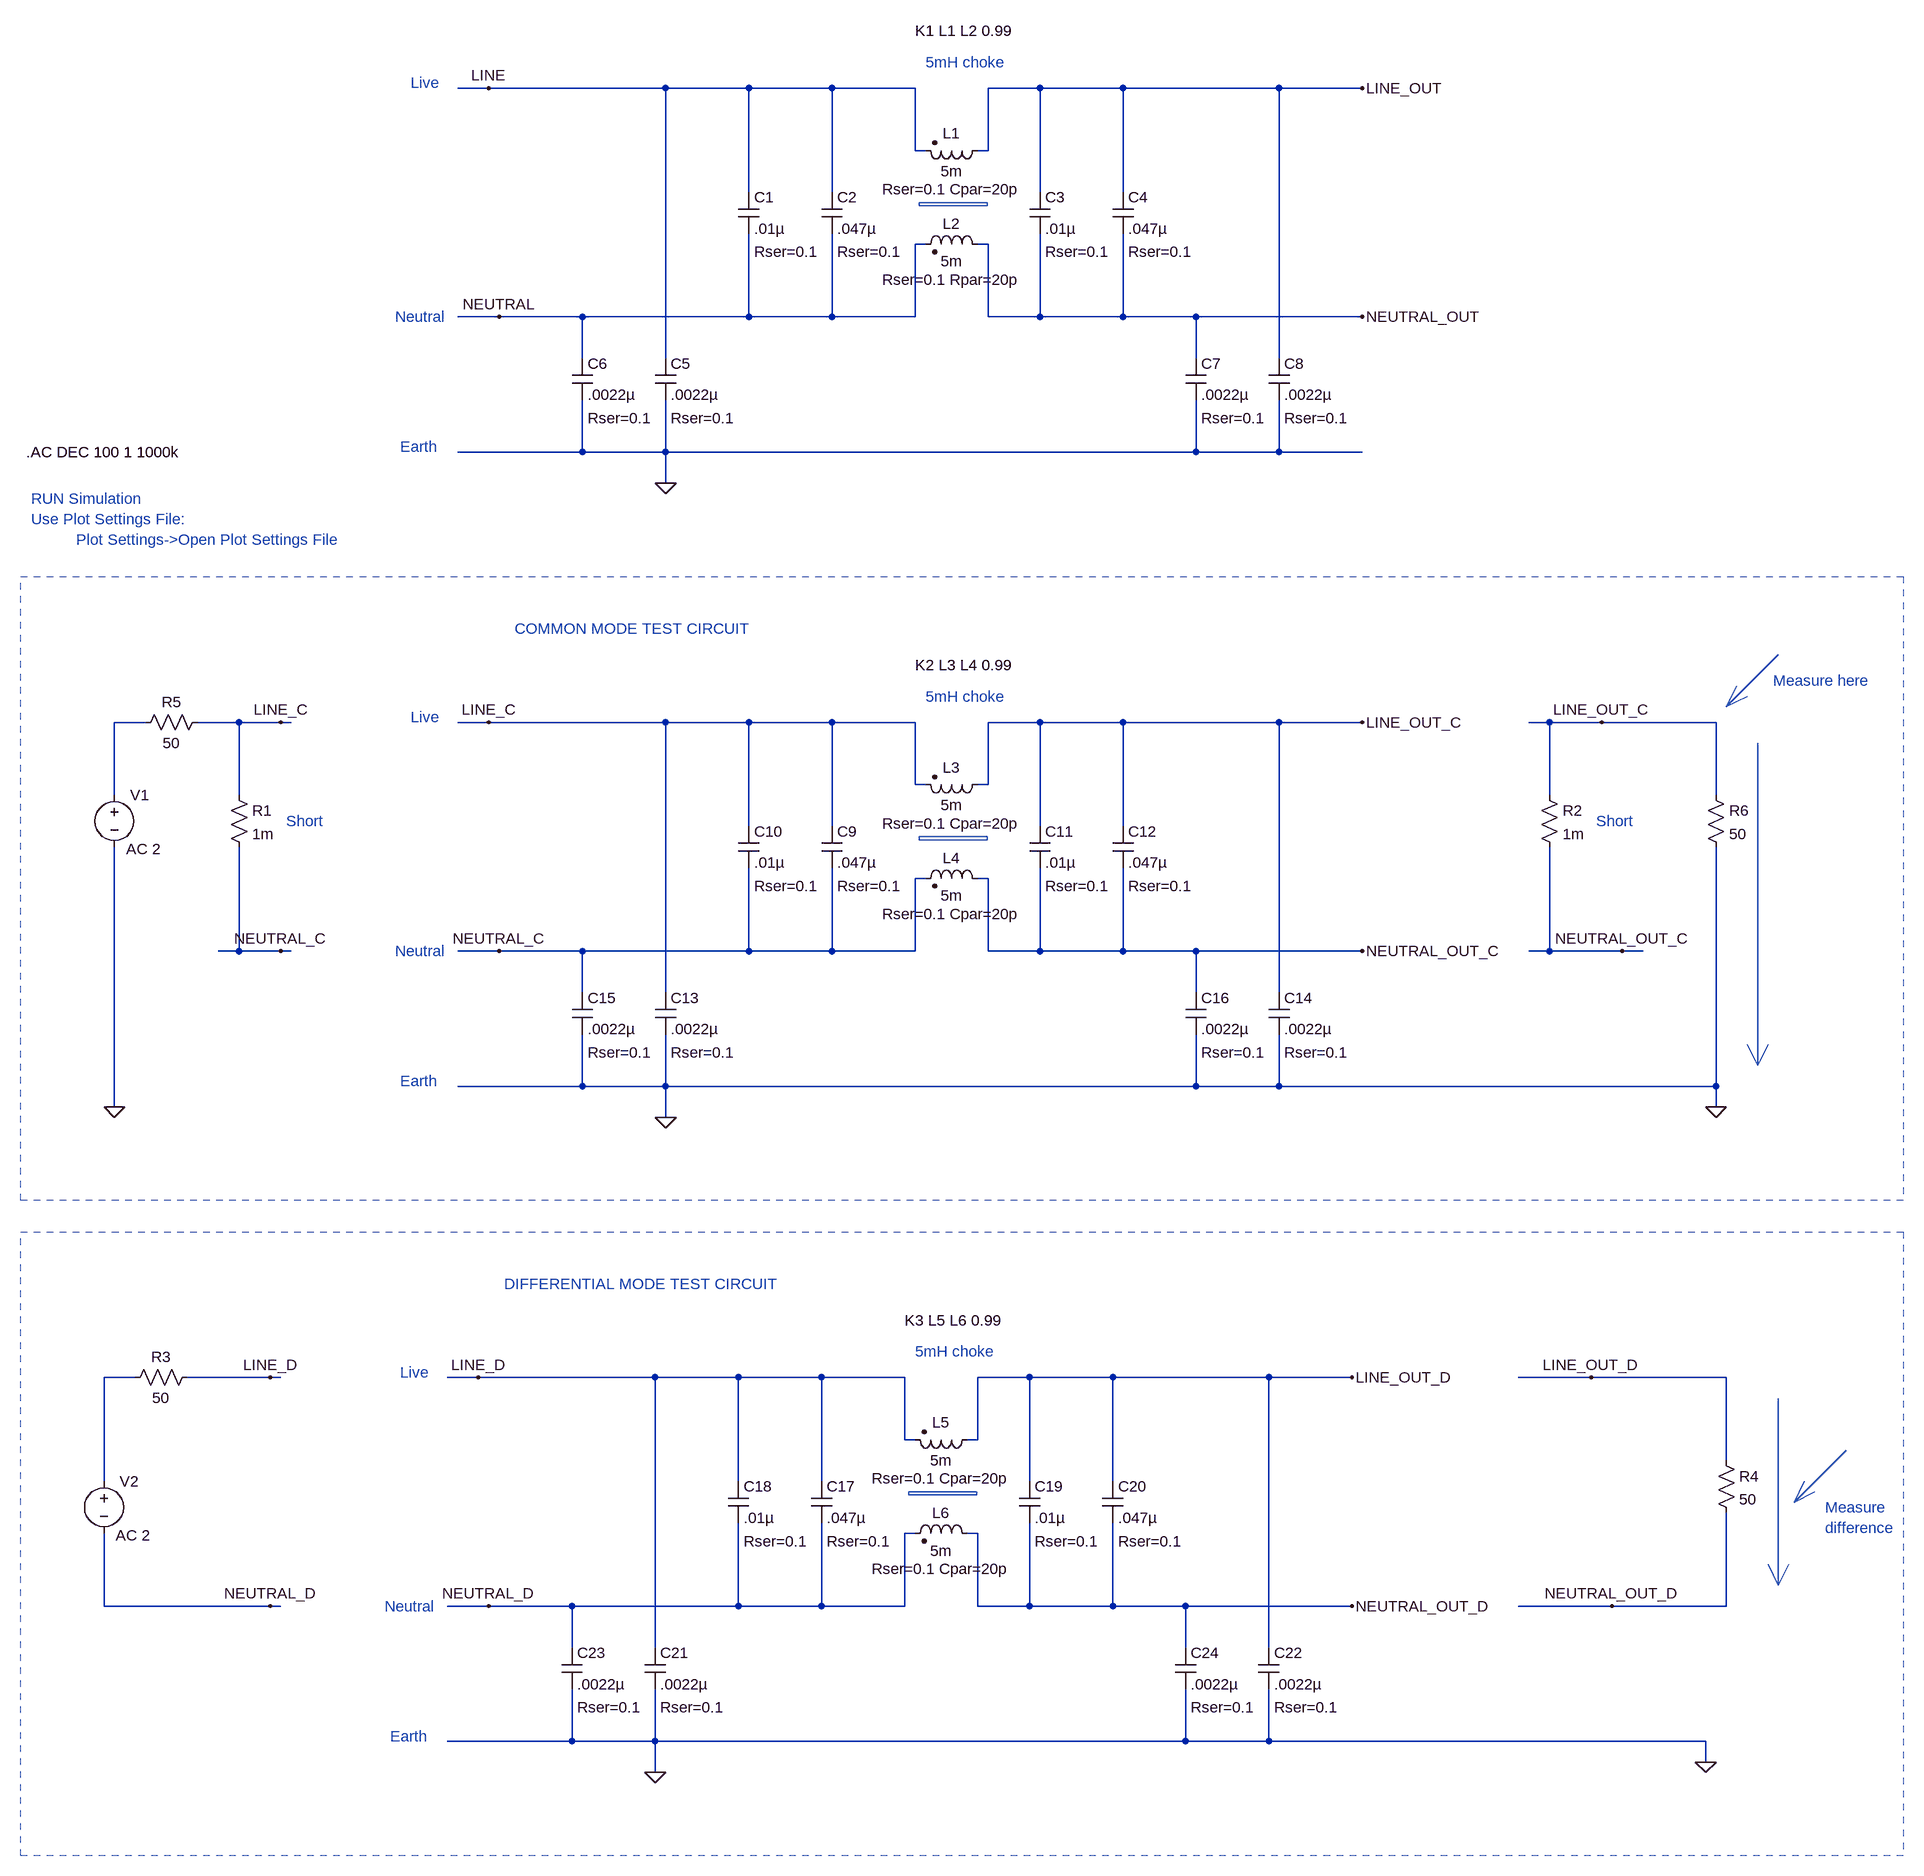
[diagram p0: schematic Mains_Filter2.asc]
Mains_Filter2.asc, the LTspice schematic file:
Version 4
SHEET 1 1508 1908
WIRE -320 -768 -320 -864
WIRE -320 -864 -448 -864
WIRE -320 -624 -320 -512
WIRE -320 -512 -448 -512
WIRE -208 -768 -208 -864
WIRE -208 -864 -128 -864
WIRE -448 -704 -448 -864
WIRE -448 -864 -576 -864
WIRE -448 -640 -448 -512
WIRE -448 -512 -576 -512
WIRE -576 -704 -576 -864
WIRE -576 -864 -704 -864
WIRE -576 -640 -576 -512
WIRE -576 -512 -832 -512
WIRE -128 -704 -128 -864
WIRE -128 -864 0 -864
WIRE -128 -640 -128 -512
WIRE -128 -512 0 -512
WIRE 0 -704 0 -864
WIRE 240 -864 0 -864
WIRE 0 -640 0 -512
WIRE -704 -448 -704 -864
WIRE -704 -864 -976 -864
WIRE -704 -384 -704 -304
WIRE -704 -304 112 -304
WIRE 240 -384 240 -304
WIRE 112 -304 240 -304
WIRE -832 -448 -832 -512
WIRE -832 -384 -832 -304
WIRE 112 -448 112 -512
WIRE 112 -384 112 -304
WIRE -1552 112 -1504 112
WIRE -1552 112 -1552 224
WIRE -1424 112 -1360 112
WIRE -1296 112 -1280 112
WIRE -960 -512 -1024 -512
WIRE -1552 704 -1552 304
WIRE 240 -864 368 -864
WIRE 112 -512 368 -512
WIRE -1024 -304 -832 -304
WIRE -704 -304 -704 -256
WIRE 240 -304 368 -304
WIRE 240 -448 240 -864
WIRE -208 -624 -208 -512
WIRE -208 -512 -128 -512
WIRE -832 -512 -960 -512
WIRE -832 -304 -704 -304
WIRE -224 -768 -208 -768
WIRE -304 -768 -320 -768
WIRE -304 -624 -320 -624
WIRE -224 -624 -208 -624
WIRE 112 -512 0 -512
WIRE -976 -864 -1024 -864
WIRE -320 208 -320 112
WIRE -320 112 -448 112
WIRE -320 352 -320 464
WIRE -320 464 -448 464
WIRE -208 208 -208 112
WIRE -208 112 -128 112
WIRE -448 272 -448 112
WIRE -448 112 -576 112
WIRE -448 336 -448 464
WIRE -448 464 -576 464
WIRE -576 272 -576 112
WIRE -576 112 -704 112
WIRE -576 336 -576 464
WIRE -576 464 -832 464
WIRE -128 272 -128 112
WIRE -128 112 0 112
WIRE -128 336 -128 464
WIRE -128 464 0 464
WIRE 0 272 0 112
WIRE 240 112 0 112
WIRE 0 336 0 464
WIRE -704 528 -704 112
WIRE -704 112 -976 112
WIRE -704 592 -704 672
WIRE -704 672 112 672
WIRE 240 592 240 672
WIRE 112 672 240 672
WIRE -832 528 -832 464
WIRE -832 592 -832 672
WIRE 112 528 112 464
WIRE 112 592 112 672
WIRE -960 464 -1024 464
WIRE 240 112 368 112
WIRE 112 464 368 464
WIRE -1024 672 -832 672
WIRE -704 672 -704 720
WIRE 240 672 912 672
WIRE 240 528 240 112
WIRE -208 352 -208 464
WIRE -208 464 -128 464
WIRE -832 464 -960 464
WIRE -832 672 -704 672
WIRE -224 208 -208 208
WIRE -304 208 -320 208
WIRE -304 352 -320 352
WIRE -224 352 -208 352
WIRE 112 464 0 464
WIRE -976 112 -1024 112
WIRE -1360 224 -1360 112
WIRE -1360 112 -1296 112
WIRE -1360 304 -1360 464
WIRE -1392 464 -1360 464
WIRE -1360 464 -1296 464
WIRE -1296 464 -1280 464
WIRE 656 112 736 112
WIRE 656 224 656 112
WIRE 656 304 656 464
WIRE 624 464 656 464
WIRE 656 464 768 464
WIRE 768 464 800 464
WIRE 656 112 624 112
WIRE 912 704 912 672
WIRE 736 112 912 112
WIRE -1568 1120 -1520 1120
WIRE -1568 1120 -1568 1280
WIRE -1440 1120 -1312 1120
WIRE -1312 1120 -1296 1120
WIRE -1568 1472 -1568 1360
WIRE -336 1216 -336 1120
WIRE -336 1120 -464 1120
WIRE -336 1360 -336 1472
WIRE -336 1472 -464 1472
WIRE -224 1216 -224 1120
WIRE -224 1120 -144 1120
WIRE -464 1280 -464 1120
WIRE -464 1120 -592 1120
WIRE -464 1344 -464 1472
WIRE -464 1472 -592 1472
WIRE -592 1280 -592 1120
WIRE -592 1120 -720 1120
WIRE -592 1344 -592 1472
WIRE -592 1472 -848 1472
WIRE -144 1280 -144 1120
WIRE -144 1120 -16 1120
WIRE -144 1344 -144 1472
WIRE -144 1472 -16 1472
WIRE -16 1280 -16 1120
WIRE 224 1120 -16 1120
WIRE -16 1344 -16 1472
WIRE -720 1536 -720 1120
WIRE -720 1120 -992 1120
WIRE -720 1600 -720 1680
WIRE -720 1680 96 1680
WIRE 224 1600 224 1680
WIRE 96 1680 224 1680
WIRE -848 1536 -848 1472
WIRE -848 1600 -848 1680
WIRE 96 1536 96 1472
WIRE 96 1600 96 1680
WIRE -976 1472 -1040 1472
WIRE 224 1120 352 1120
WIRE 96 1472 352 1472
WIRE -1040 1680 -848 1680
WIRE -720 1680 -720 1728
WIRE 224 1680 896 1680
WIRE 224 1536 224 1120
WIRE -224 1360 -224 1472
WIRE -224 1472 -144 1472
WIRE -848 1472 -976 1472
WIRE -848 1680 -720 1680
WIRE -240 1216 -224 1216
WIRE -320 1216 -336 1216
WIRE -320 1360 -336 1360
WIRE -240 1360 -224 1360
WIRE 96 1472 -16 1472
WIRE -992 1120 -1040 1120
WIRE -1568 1472 -1312 1472
WIRE -1312 1472 -1296 1472
WIRE 608 1120 720 1120
WIRE 608 1472 752 1472
WIRE 896 1712 896 1680
WIRE 720 1120 928 1120
WIRE 928 1248 928 1120
WIRE 928 1328 928 1472
WIRE 752 1472 928 1472
WIRE 912 224 912 112
WIRE 912 304 912 672
FLAG -704 -256 0
FLAG -1296 112 LINE_C
FLAG -976 -864 LINE
FLAG -960 -512 NEUTRAL
FLAG 368 -864 LINE_OUT
FLAG 368 -512 NEUTRAL_OUT
FLAG -1552 704 0
FLAG -704 720 0
FLAG -976 112 LINE_C
FLAG -960 464 NEUTRAL_C
FLAG 368 112 LINE_OUT_C
FLAG 368 464 NEUTRAL_OUT_C
FLAG -1296 464 NEUTRAL_C
FLAG 736 112 LINE_OUT_C
FLAG 768 464 NEUTRAL_OUT_C
FLAG 912 704 0
FLAG -1312 1120 LINE_D
FLAG -720 1728 0
FLAG -992 1120 LINE_D
FLAG -976 1472 NEUTRAL_D
FLAG 352 1120 LINE_OUT_D
FLAG 352 1472 NEUTRAL_OUT_D
FLAG -1312 1472 NEUTRAL_D
FLAG 720 1120 LINE_OUT_D
FLAG 752 1472 NEUTRAL_OUT_D
FLAG 896 1712 0
SYMBOL ind2 -208 -784 R90
WINDOW 0 5 56 VBottom 0
WINDOW 3 32 56 VTop 0
WINDOW 39 60 56 VTop 0
SYMATTR InstName L1
SYMATTR Value 5m
SYMATTR Type ind
SYMATTR SpiceLine Rser=0.1 Cpar=20p
SYMBOL cap -464 -704 R0
WINDOW 39 24 92 Left 0
SYMATTR InstName C2
SYMATTR Value .047µ
SYMATTR SpiceLine Rser=0.1
SYMBOL cap -592 -704 R0
WINDOW 39 24 92 Left 0
SYMATTR InstName C1
SYMATTR Value .01µ
SYMATTR SpiceLine Rser=0.1
SYMBOL cap -144 -704 R0
WINDOW 39 24 92 Left 0
SYMATTR InstName C3
SYMATTR Value .01µ
SYMATTR SpiceLine Rser=0.1
SYMBOL cap -16 -704 R0
WINDOW 39 24 92 Left 0
SYMATTR InstName C4
SYMATTR Value .047µ
SYMATTR SpiceLine Rser=0.1
SYMBOL cap -720 -448 R0
WINDOW 39 24 92 Left 0
SYMATTR InstName C5
SYMATTR Value .0022µ
SYMATTR SpiceLine Rser=0.1
SYMBOL cap 224 -448 R0
WINDOW 39 24 92 Left 0
SYMATTR InstName C8
SYMATTR Value .0022µ
SYMATTR SpiceLine Rser=0.1
SYMBOL ind2 -208 -608 M270
WINDOW 0 32 56 VTop 0
WINDOW 3 5 56 VBottom 0
WINDOW 39 -23 56 VBottom 0
SYMATTR InstName L2
SYMATTR Value 5m
SYMATTR Type ind
SYMATTR SpiceLine Rser=0.1 Rpar=20p
SYMBOL cap -848 -448 R0
WINDOW 39 24 92 Left 0
SYMATTR InstName C6
SYMATTR Value .0022µ
SYMATTR SpiceLine Rser=0.1
SYMBOL cap 96 -448 R0
WINDOW 39 24 92 Left 0
SYMATTR InstName C7
SYMATTR Value .0022µ
SYMATTR SpiceLine Rser=0.1
SYMBOL res -1520 128 R270
WINDOW 0 32 56 VTop 0
WINDOW 3 0 56 VBottom 0
SYMATTR InstName R5
SYMATTR Value 50
SYMBOL voltage -1552 208 R0
WINDOW 123 18 99 Left 0
WINDOW 39 0 0 Left 0
SYMATTR InstName V1
SYMATTR Value ""
SYMATTR Value2 AC 2
SYMBOL ind2 -208 192 R90
WINDOW 0 5 56 VBottom 0
WINDOW 3 32 56 VTop 0
WINDOW 39 60 56 VTop 0
SYMATTR InstName L3
SYMATTR Value 5m
SYMATTR Type ind
SYMATTR SpiceLine Rser=0.1 Cpar=20p
SYMBOL cap -464 272 R0
WINDOW 39 24 92 Left 0
SYMATTR InstName C9
SYMATTR Value .047µ
SYMATTR SpiceLine Rser=0.1
SYMBOL cap -592 272 R0
WINDOW 39 24 92 Left 0
SYMATTR InstName C10
SYMATTR Value .01µ
SYMATTR SpiceLine Rser=0.1
SYMBOL cap -144 272 R0
WINDOW 39 24 92 Left 0
SYMATTR InstName C11
SYMATTR Value .01µ
SYMATTR SpiceLine Rser=0.1
SYMBOL cap -16 272 R0
WINDOW 39 24 92 Left 0
SYMATTR InstName C12
SYMATTR Value .047µ
SYMATTR SpiceLine Rser=0.1
SYMBOL cap -720 528 R0
WINDOW 39 24 92 Left 0
SYMATTR InstName C13
SYMATTR Value .0022µ
SYMATTR SpiceLine Rser=0.1
SYMBOL cap 224 528 R0
WINDOW 39 24 92 Left 0
SYMATTR InstName C14
SYMATTR Value .0022µ
SYMATTR SpiceLine Rser=0.1
SYMBOL ind2 -208 368 M270
WINDOW 0 32 56 VTop 0
WINDOW 3 5 56 VBottom 0
WINDOW 39 -23 56 VBottom 0
SYMATTR InstName L4
SYMATTR Value 5m
SYMATTR Type ind
SYMATTR SpiceLine Rser=0.1 Cpar=20p
SYMBOL cap -848 528 R0
WINDOW 39 24 92 Left 0
SYMATTR InstName C15
SYMATTR Value .0022µ
SYMATTR SpiceLine Rser=0.1
SYMBOL cap 96 528 R0
WINDOW 39 24 92 Left 0
SYMATTR InstName C16
SYMATTR Value .0022µ
SYMATTR SpiceLine Rser=0.1
SYMBOL res -1376 208 R0
SYMATTR InstName R1
SYMATTR Value 1m
SYMBOL res 640 208 R0
SYMATTR InstName R2
SYMATTR Value 1m
SYMBOL res -1536 1136 R270
WINDOW 0 32 56 VTop 0
WINDOW 3 0 56 VBottom 0
SYMATTR InstName R3
SYMATTR Value 50
SYMBOL voltage -1568 1264 R0
WINDOW 123 18 99 Left 0
WINDOW 39 0 0 Left 0
SYMATTR InstName V2
SYMATTR Value ""
SYMATTR Value2 AC 2
SYMBOL ind2 -224 1200 R90
WINDOW 0 5 56 VBottom 0
WINDOW 3 32 56 VTop 0
WINDOW 39 60 56 VTop 0
SYMATTR InstName L5
SYMATTR Value 5m
SYMATTR Type ind
SYMATTR SpiceLine Rser=0.1 Cpar=20p
SYMBOL cap -480 1280 R0
WINDOW 39 24 92 Left 0
SYMATTR InstName C17
SYMATTR Value .047µ
SYMATTR SpiceLine Rser=0.1
SYMBOL cap -608 1280 R0
WINDOW 39 24 92 Left 0
SYMATTR InstName C18
SYMATTR Value .01µ
SYMATTR SpiceLine Rser=0.1
SYMBOL cap -160 1280 R0
WINDOW 39 24 92 Left 0
SYMATTR InstName C19
SYMATTR Value .01µ
SYMATTR SpiceLine Rser=0.1
SYMBOL cap -32 1280 R0
WINDOW 39 24 92 Left 0
SYMATTR InstName C20
SYMATTR Value .047µ
SYMATTR SpiceLine Rser=0.1
SYMBOL cap -736 1536 R0
WINDOW 39 24 92 Left 0
SYMATTR InstName C21
SYMATTR Value .0022µ
SYMATTR SpiceLine Rser=0.1
SYMBOL cap 208 1536 R0
WINDOW 39 24 92 Left 0
SYMATTR InstName C22
SYMATTR Value .0022µ
SYMATTR SpiceLine Rser=0.1
SYMBOL ind2 -224 1376 M270
WINDOW 0 32 56 VTop 0
WINDOW 3 5 56 VBottom 0
WINDOW 39 -23 56 VBottom 0
SYMATTR InstName L6
SYMATTR Value 5m
SYMATTR Type ind
SYMATTR SpiceLine Rser=0.1 Cpar=20p
SYMBOL cap -864 1536 R0
WINDOW 39 24 92 Left 0
SYMATTR InstName C23
SYMATTR Value .0022µ
SYMATTR SpiceLine Rser=0.1
SYMBOL cap 80 1536 R0
WINDOW 39 24 92 Left 0
SYMATTR InstName C24
SYMATTR Value .0022µ
SYMATTR SpiceLine Rser=0.1
SYMBOL res 912 1232 R0
SYMATTR InstName R4
SYMATTR Value 50
SYMBOL res 896 208 R0
SYMATTR InstName R6
SYMATTR Value 50
TEXT -304 -904 Left 0 ;5mH choke
TEXT -1096 -872 Left 0 ;Live
TEXT -1120 -512 Left 0 ;Neutral
TEXT -1112 -312 Left 0 ;Earth
TEXT -320 -952 Left 0 !K1 L1 L2 0.99
TEXT -1688 -304 Left 0 !.AC DEC 100 1 1000k
TEXT -304 72 Left 0 ;5mH choke
TEXT -1096 104 Left 0 ;Live
TEXT -1120 464 Left 0 ;Neutral
TEXT -1112 664 Left 0 ;Earth
TEXT -320 24 Left 0 !K2 L3 L4 0.99
TEXT -1288 264 Left 0 ;Short
TEXT 728 264 Left 0 ;Short
TEXT 1000 48 Left 0 ;Measure here
TEXT -936 -32 Left 0 ;COMMON MODE TEST CIRCUIT
TEXT -320 1080 Left 0 ;5mH choke
TEXT -1112 1112 Left 0 ;Live
TEXT -1136 1472 Left 0 ;Neutral
TEXT -1128 1672 Left 0 ;Earth
TEXT -336 1032 Left 0 !K3 L5 L6 0.99
TEXT -952 976 Left 0 ;DIFFERENTIAL MODE TEST CIRCUIT
TEXT 1080 1320 Left 0 ;Measure \ndifference
TEXT -1680 -232 Left 0 ;RUN Simulation\nUse Plot Settings File: \n          Plot Settings->Open Plot Settings File
LINE Normal 928 88 1008 8
LINE Normal 960 72 928 88
LINE Normal 944 56 928 88
LINE Normal 976 640 976 144
LINE Normal 960 608 976 640
LINE Normal 992 608 976 640
LINE Normal 1008 1440 1008 1152
LINE Normal 992 1408 1008 1440
LINE Normal 1024 1408 1008 1440
LINE Normal 1032 1312 1112 1232
LINE Normal 1064 1296 1032 1312
LINE Normal 1048 1280 1032 1312
RECTANGLE Normal -209 -683 -314 -688
RECTANGLE Normal -209 293 -314 288
RECTANGLE Normal -225 1301 -330 1296
RECTANGLE Normal 1200 848 -1696 -112 2
RECTANGLE Normal 1200 1856 -1696 896 2

The netlist it stands for:
* Mains_Filter2.asc
L1 LINE_OUT LINE 5m Rser=0.1 Cpar=20p
C2 LINE NEUTRAL .047µ Rser=0.1
C1 LINE NEUTRAL .01µ Rser=0.1
C3 LINE_OUT NEUTRAL_OUT .01µ Rser=0.1
C4 LINE_OUT NEUTRAL_OUT .047µ Rser=0.1
C5 LINE 0 .0022µ Rser=0.1
C8 LINE_OUT 0 .0022µ Rser=0.1
L2 NEUTRAL_OUT NEUTRAL 5m Rser=0.1 Rpar=20p
C6 NEUTRAL 0 .0022µ Rser=0.1
C7 NEUTRAL_OUT 0 .0022µ Rser=0.1
R5 N001 LINE_C 50
V1 N001 0 AC 2
L3 LINE_OUT_C LINE_C 5m Rser=0.1 Cpar=20p
C9 LINE_C NEUTRAL_C .047µ Rser=0.1
C10 LINE_C NEUTRAL_C .01µ Rser=0.1
C11 LINE_OUT_C NEUTRAL_OUT_C .01µ Rser=0.1
C12 LINE_OUT_C NEUTRAL_OUT_C .047µ Rser=0.1
C13 LINE_C 0 .0022µ Rser=0.1
C14 LINE_OUT_C 0 .0022µ Rser=0.1
L4 NEUTRAL_OUT_C NEUTRAL_C 5m Rser=0.1 Cpar=20p
C15 NEUTRAL_C 0 .0022µ Rser=0.1
C16 NEUTRAL_OUT_C 0 .0022µ Rser=0.1
R1 LINE_C NEUTRAL_C 1m
R2 LINE_OUT_C NEUTRAL_OUT_C 1m
R3 N002 LINE_D 50
V2 N002 NEUTRAL_D AC 2
L5 LINE_OUT_D LINE_D 5m Rser=0.1 Cpar=20p
C17 LINE_D NEUTRAL_D .047µ Rser=0.1
C18 LINE_D NEUTRAL_D .01µ Rser=0.1
C19 LINE_OUT_D NEUTRAL_OUT_D .01µ Rser=0.1
C20 LINE_OUT_D NEUTRAL_OUT_D .047µ Rser=0.1
C21 LINE_D 0 .0022µ Rser=0.1
C22 LINE_OUT_D 0 .0022µ Rser=0.1
L6 NEUTRAL_OUT_D NEUTRAL_D 5m Rser=0.1 Cpar=20p
C23 NEUTRAL_D 0 .0022µ Rser=0.1
C24 NEUTRAL_OUT_D 0 .0022µ Rser=0.1
R4 LINE_OUT_D NEUTRAL_OUT_D 50
R6 LINE_OUT_C 0 50
* 5mH choke
* Live
* Neutral
* Earth
K1 L1 L2 0.99
.AC DEC 100 1 1000k
* 5mH choke
* Live
* Neutral
* Earth
K2 L3 L4 0.99
* Short
* Short
* Measure here
* COMMON MODE TEST CIRCUIT
* 5mH choke
* Live
* Neutral
* Earth
K3 L5 L6 0.99
* DIFFERENTIAL MODE TEST CIRCUIT
* Measure
* difference
* RUN Simulation
* Use Plot Settings File:
*           Plot Settings->Open Plot Settings File
.backanno
.end